# Altium schematic sheet Barometer.SchDoc
size A; SheetNumber: 6
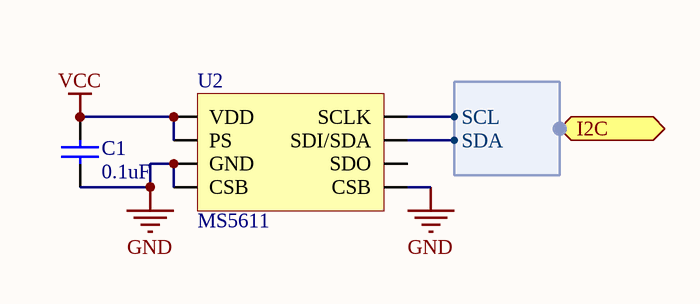
[diagram p0: Barometer.SchDoc]

## Parts
C1  value 0.1uF  [C0402[1005X55]]  (hidden comment: 0.1uF 6.3V 0402)
U2  MS5611  [MS5611]

## Ports
I2C (harness I2C)

## Harnesses
I2C: SCL, SDA

## Nets
GND: C1.1 U2.3(GND) U2.4(CSB) U2.5(CSB)
VCC: C1.2 U2.1(VDD) U2.2(PS)
NetU2_7: U2.7(SDI/SDA) ; port I2C.SDA
NetU2_8: U2.8(SCLK) ; port I2C.SCL

Not connected (* = marked no-connect by the designer): U2 6(SDO)

## Library data of the parts
C1 = CAP_0.1uF_6.3V_0402_10%: 0.1uF 6.3V 10% 0402 (1005 Metric); PartNumber: GRM155R70J104KA01D; Manufacturer: Murata; Tolerance: 10%; Mounting Technology: Surface Mount; PackageReference: 0402; PackageDescription: 0402 (1005 Metric); Voltage: 6.3V